# EAGLE design ffc_adapter (EAGLE 9.4.2)
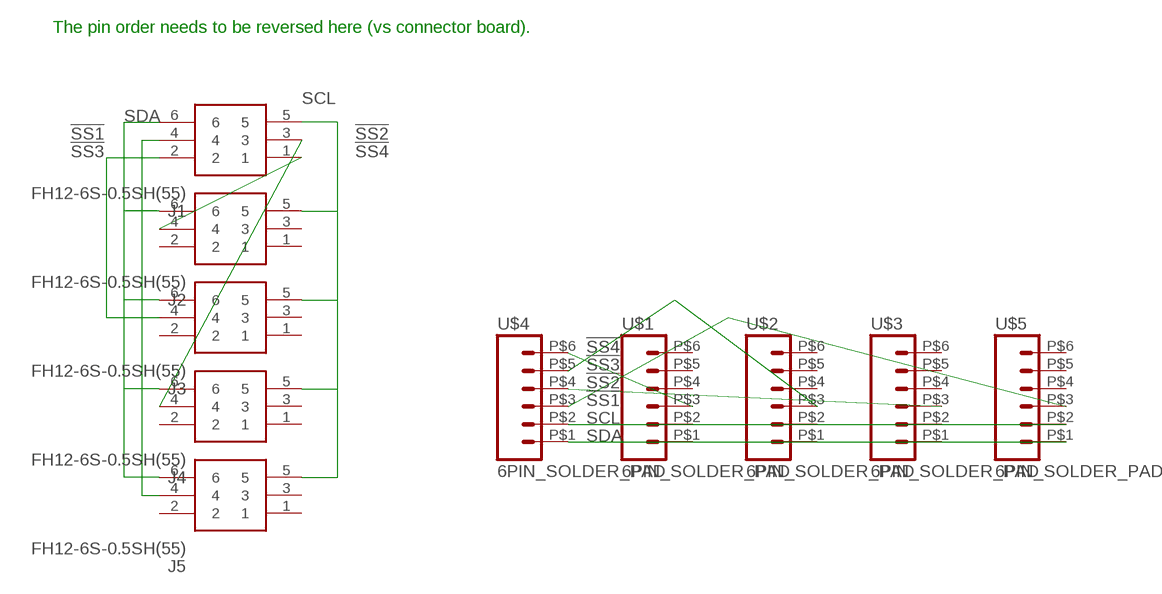
[diagram p0: schematic, sheet 1]

## Parts
J1  FH12-6S-0.5SH(55)  [FH12-6S-0.5SH(55)_1]
J2  FH12-6S-0.5SH(55)  [FH12-6S-0.5SH(55)_1]
J3  FH12-6S-0.5SH(55)  [FH12-6S-0.5SH(55)_1]
J4  FH12-6S-0.5SH(55)  [FH12-6S-0.5SH(55)_1]
J5  FH12-6S-0.5SH(55)  [FH12-6S-0.5SH(55)_1]
U$1  6PIN_SOLDER_PAD  [6PIN_SOLDER_PAD]
U$2  6PIN_SOLDER_PAD  [6PIN_SOLDER_PAD]
U$3  6PIN_SOLDER_PAD  [6PIN_SOLDER_PAD]
U$4  6PIN_SOLDER_PAD  [6PIN_SOLDER_PAD]
U$5  6PIN_SOLDER_PAD  [6PIN_SOLDER_PAD]

## Nets
!SS1: J1.4 J5.4 U$4.P$3 U$5.P$3
!SS2: J1.3 J4.4 U$3.P$3 U$4.P$4
!SS3: J1.2 J3.4 U$2.P$3 U$4.P$5
!SS4: J1.1 J2.4 U$1.P$3 U$4.P$6
SCL: J1.5 J2.5 J3.5 J4.5 J5.5 U$1.P$2 U$2.P$2 U$3.P$2 U$4.P$2 U$5.P$2
SDA: J1.6 J2.6 J3.6 J4.6 J5.6 U$1.P$1 U$2.P$1 U$3.P$1 U$4.P$1 U$5.P$1
Unconnected: J2.1 J2.2 J2.3 J3.1 J3.2 J3.3 J4.1 J4.2 J4.3 J5.1 J5.2 J5.3 U$1.P$4 U$1.P$5 U$1.P$6 U$2.P$4 U$2.P$5 U$2.P$6 U$3.P$4 U$3.P$5 U$3.P$6 U$5.P$4 U$5.P$5 U$5.P$6

## Notes on the sheet
- The pin order needs to be reversed here (vs connector board).

## Library data of the parts
J1-J5 = FH12-6S-0.5SH(55):FH12-6S-0.5SH(55): HIROSE(HRS) - FH12-6S-0.5SH(55) - FFC/FPC CONNECTOR, RECEPTACLE, 6POS 1ROW Source: Datasheet <https://www.hirose.com/product/en/download_file/key_name/FH12-6S-0.5SH(55)/category/Drawing (2D)/doc_file_id/75611/?file_category_id=6&item_id=05860582555&is_series=>; DESCRIPTION: HIROSE(HRS) - FH12-6S-0.5SH(55) - FFC/FPC CONNECTOR, RECEPTACLE, 6POS 1ROW; HEIGHT: mm; MANUFACTURER_NAME: Hirose; MANUFACTURER_PART_NUMBER: FH12-6S-0.5SH(55); MOUSER_PART_NUMBER: 798-FH12-6S-0.5SH55; MOUSER_PRICE-STOCK: https://www.mouser.com/Search/Refine.aspx?Keyword=798-FH12-6S-0.5SH55; RS_PART_NUMBER: 7388811P; RS_PRICE-STOCK: http://uk.rs-online.com/web/p/products/7388811P
U$1-U$5 = edge:6PIN_SOLDER_PAD

## Board
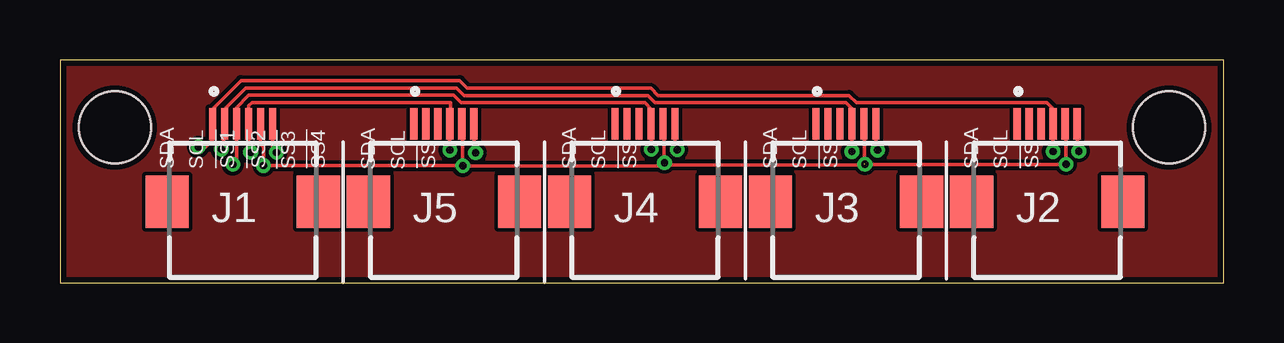
[diagram p1: board, top side]
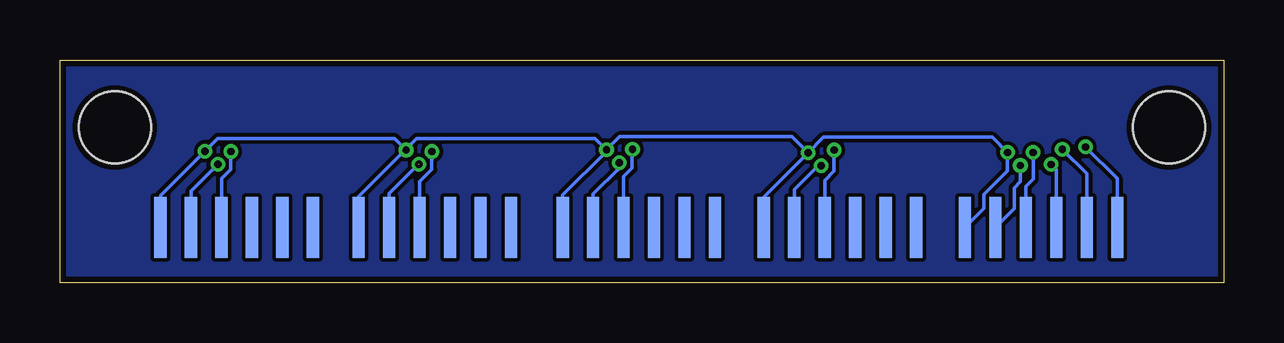
[diagram p2: board, bottom side, seen from below]

Size 48.51 x 9.3 mm. Coordinates in mm from the lower left corner, seen from the top.
Outline: 0,0 48.51,0 48.51,9.3 0,9.3 0,0
Copper layers (1*16): Top 0.035mm / dielectric 1.5mm / Bottom 0.035mm
Design rules "SeeedStudio_2layer_DRU_no_angle_20140221": minimum track width 6mil, minimum drill 12mil, track to track 6mil, track to pad 6mil, pad to pad 6mil, via to via 6mil, smd to smd 0mil, copper to edge 10mil, drill to drill 10mil, minimum pad ring 10mil, minimum via ring 6mil, stop-mask expansion 2mil, vias tented up to drill 100mil, thermal gap 10mil
Holes 3 mm at 2.29,6.48 46.23,6.48

### Footprints (pad centres in the part's own frame; a part is rotated, then mirrored left to right if it is on the bottom)
FH12-6S-0.5SH(55)_1 = smd 0.3 x 1.3: 1 -1.25,0; 2 -0.75,0; 3 -0.25,0; 4 0.25,0; 5 0.75,0; 6 1.25,0 | smd 1.8 x 2.2: 7 -3.15,-3.25; 8 3.15,-3.25
6PIN_SOLDER_PAD = smd 0.508 x 2.54: P$1 0,0; P$2 1.27,0; P$3 2.54,0; P$4 3.81,0; P$5 5.08,0; P$6 6.35,0

### Placement (x,y rotation side)
J1  7.62,6.63 0 top
J2  41.15,6.63 0 top
J3  32.77,6.63 0 top
J4  24.38,6.63 0 top
J5  16,6.63 0 top
U$1  44.32,2.31 0 bottom
U$2  36.07,2.31 0 bottom
U$3  27.56,2.31 0 bottom
U$4  10.79,2.31 0 bottom
U$5  19.18,2.31 0 bottom

### Tracks (layer width: path | path; a pad name or v marks a point on that pad's centre or on a via)
!SS1  (via drill 0.3)
  Top 0.152: v7.95,5.44 7.87,5.52 J1.4 7.87,7.39 8,7.52 16.28,7.52 16.28,6.66 J5.4 v16.24,5.54
  Bottom 0.152: v7.95,5.44 7.95,4.32 8.26,4.01 U$4.P$3 | U$5.P$3 16.64,4.28 16.26,4.66 16.26,5.53 v16.24,5.54
!SS2  (via drill 0.3)
  Top 0.152: v7.21,4.93 7.37,5.1 J1.3 7.36,7.31 7.88,7.82 16.41,7.82 16.72,7.51 24.38,7.51 24.64,7.25 J4.4 24.65,6.61 v24.65,5.56
  Bottom 0.152: v7.21,4.93 6.99,4.71 U$4.P$4 | U$3.P$3 25.02,4.43 24.66,4.78 24.66,5.55 v24.65,5.56
!SS3  (via drill 0.3)
  Top 0.152: v6.73,5.56 6.76,5.56 6.83,5.64 6.83,6.59 J1.2 6.87,7.25 7.12,7.51 7.13,7.51 7.75,8.13 16.53,8.13 16.85,7.81 24.5,7.81 24.81,7.51 32.76,7.51 33.02,7.25 J3.4 33.02,5.48 v33.01,5.47
  Bottom 0.152: v6.73,5.56 5.71,4.55 U$4.P$5 | v33.01,5.47 v33.02,5.46 33.02,4.72 33.53,4.21 U$2.P$3
!SS4  (via drill 0.3)
  Top 0.152: v5.77,5.66 6.07,5.66 6.37,5.97 J1.1 6.37,7.25 7.55,8.43 16.66,8.43 16.98,8.12 24.63,8.12 24.94,7.81 32.89,7.81 33.19,7.51 41.14,7.51 41.4,7.25 J2.4 v41.39,5.48
  Bottom 0.152: v5.77,5.66 4.45,4.34 U$4.P$6 | U$1.P$3 41.78,4.34 41.4,4.72 41.4,5.46 v41.39,5.48
GND
  pour Top: 0,0 48.51,0 48.51,9.3 0,9.3
  pour Bottom: 0,0 48.51,0 48.51,9.3 0,9.3
SCL  (via drill 0.3)  (1 unrouted)
  Top 0.152: J1.5 8.37,5.77 8.48,5.66 v8.48,4.89 16.77,4.89 v16.79,4.88 | v16.79,4.88 16.78,4.89 16.78,6.6 J5.5 | v25.2,5 25.18,5.02 25.18,6.58 J4.5 | 33.54,4.95 33.54,6.6 J3.5 | J2.5 41.9,6.6 41.92,6.58 41.92,4.96 | v41.94,4.94 41.92,4.96 | v16.79,4.88 25.07,4.88 v25.2,5 | v25.2,5 25.23,5 25.33,4.9 33.51,4.9 v33.55,4.94 41.91,4.94 41.92,4.96
  Bottom 0.152: U$4.P$2 8.74,3.1 8.74,3.96 8.48,4.22 v8.48,4.89 | U$5.P$2 17.91,3.88 16.92,4.88 v16.79,4.88 | U$3.P$2 26.29,3.7 25.2,4.79 v25.2,5 | U$2.P$2 34.8,3.73 33.59,4.94 v33.55,4.94 | U$1.P$2 43.05,3.83 v41.94,4.94
SDA  (via drill 0.3)
  Top 0.152: v9.02,5.44 8.87,5.58 J1.6 | v17.32,5.42 17.25,5.49 J5.6 | v25.73,5.55 25.63,5.64 J4.6 | v34.09,5.54 34.02,5.61 J3.6 | v42.47,5.49 42.4,5.56 J2.6
  Bottom 0.152: U$4.P$1 10.01,3.1 10.01,3.68 9.02,4.67 v9.02,5.44 9.65,6.07 16.68,6.07 v17.33,5.42 | U$5.P$1 19.18,3.57 v17.33,5.42 | v17.33,5.42 v17.32,5.42 18,6.1 25.18,6.1 v25.73,5.55 | v25.73,5.55 25.73,5.48 27.56,3.65 U$3.P$1 | U$2.P$1 36.07,3.6 34.13,5.54 | 34.13,5.54 v34.09,5.54 34.57,6.02 41.94,6.02 v42.47,5.49 44.32,3.63 U$1.P$1 | v25.73,5.55 26.2,6.02 33.65,6.02 34.13,5.54

### Text on the board
tNames: SDA | SCL | !SS1 | !SS2 | !SS3 | !SS4 | SDA | SCL | !SS | SDA | SCL | !SS | SDA | SCL | !SS | SDA | SCL | !SS